# EAGLE schematic shield (EAGLE 7.3.0)
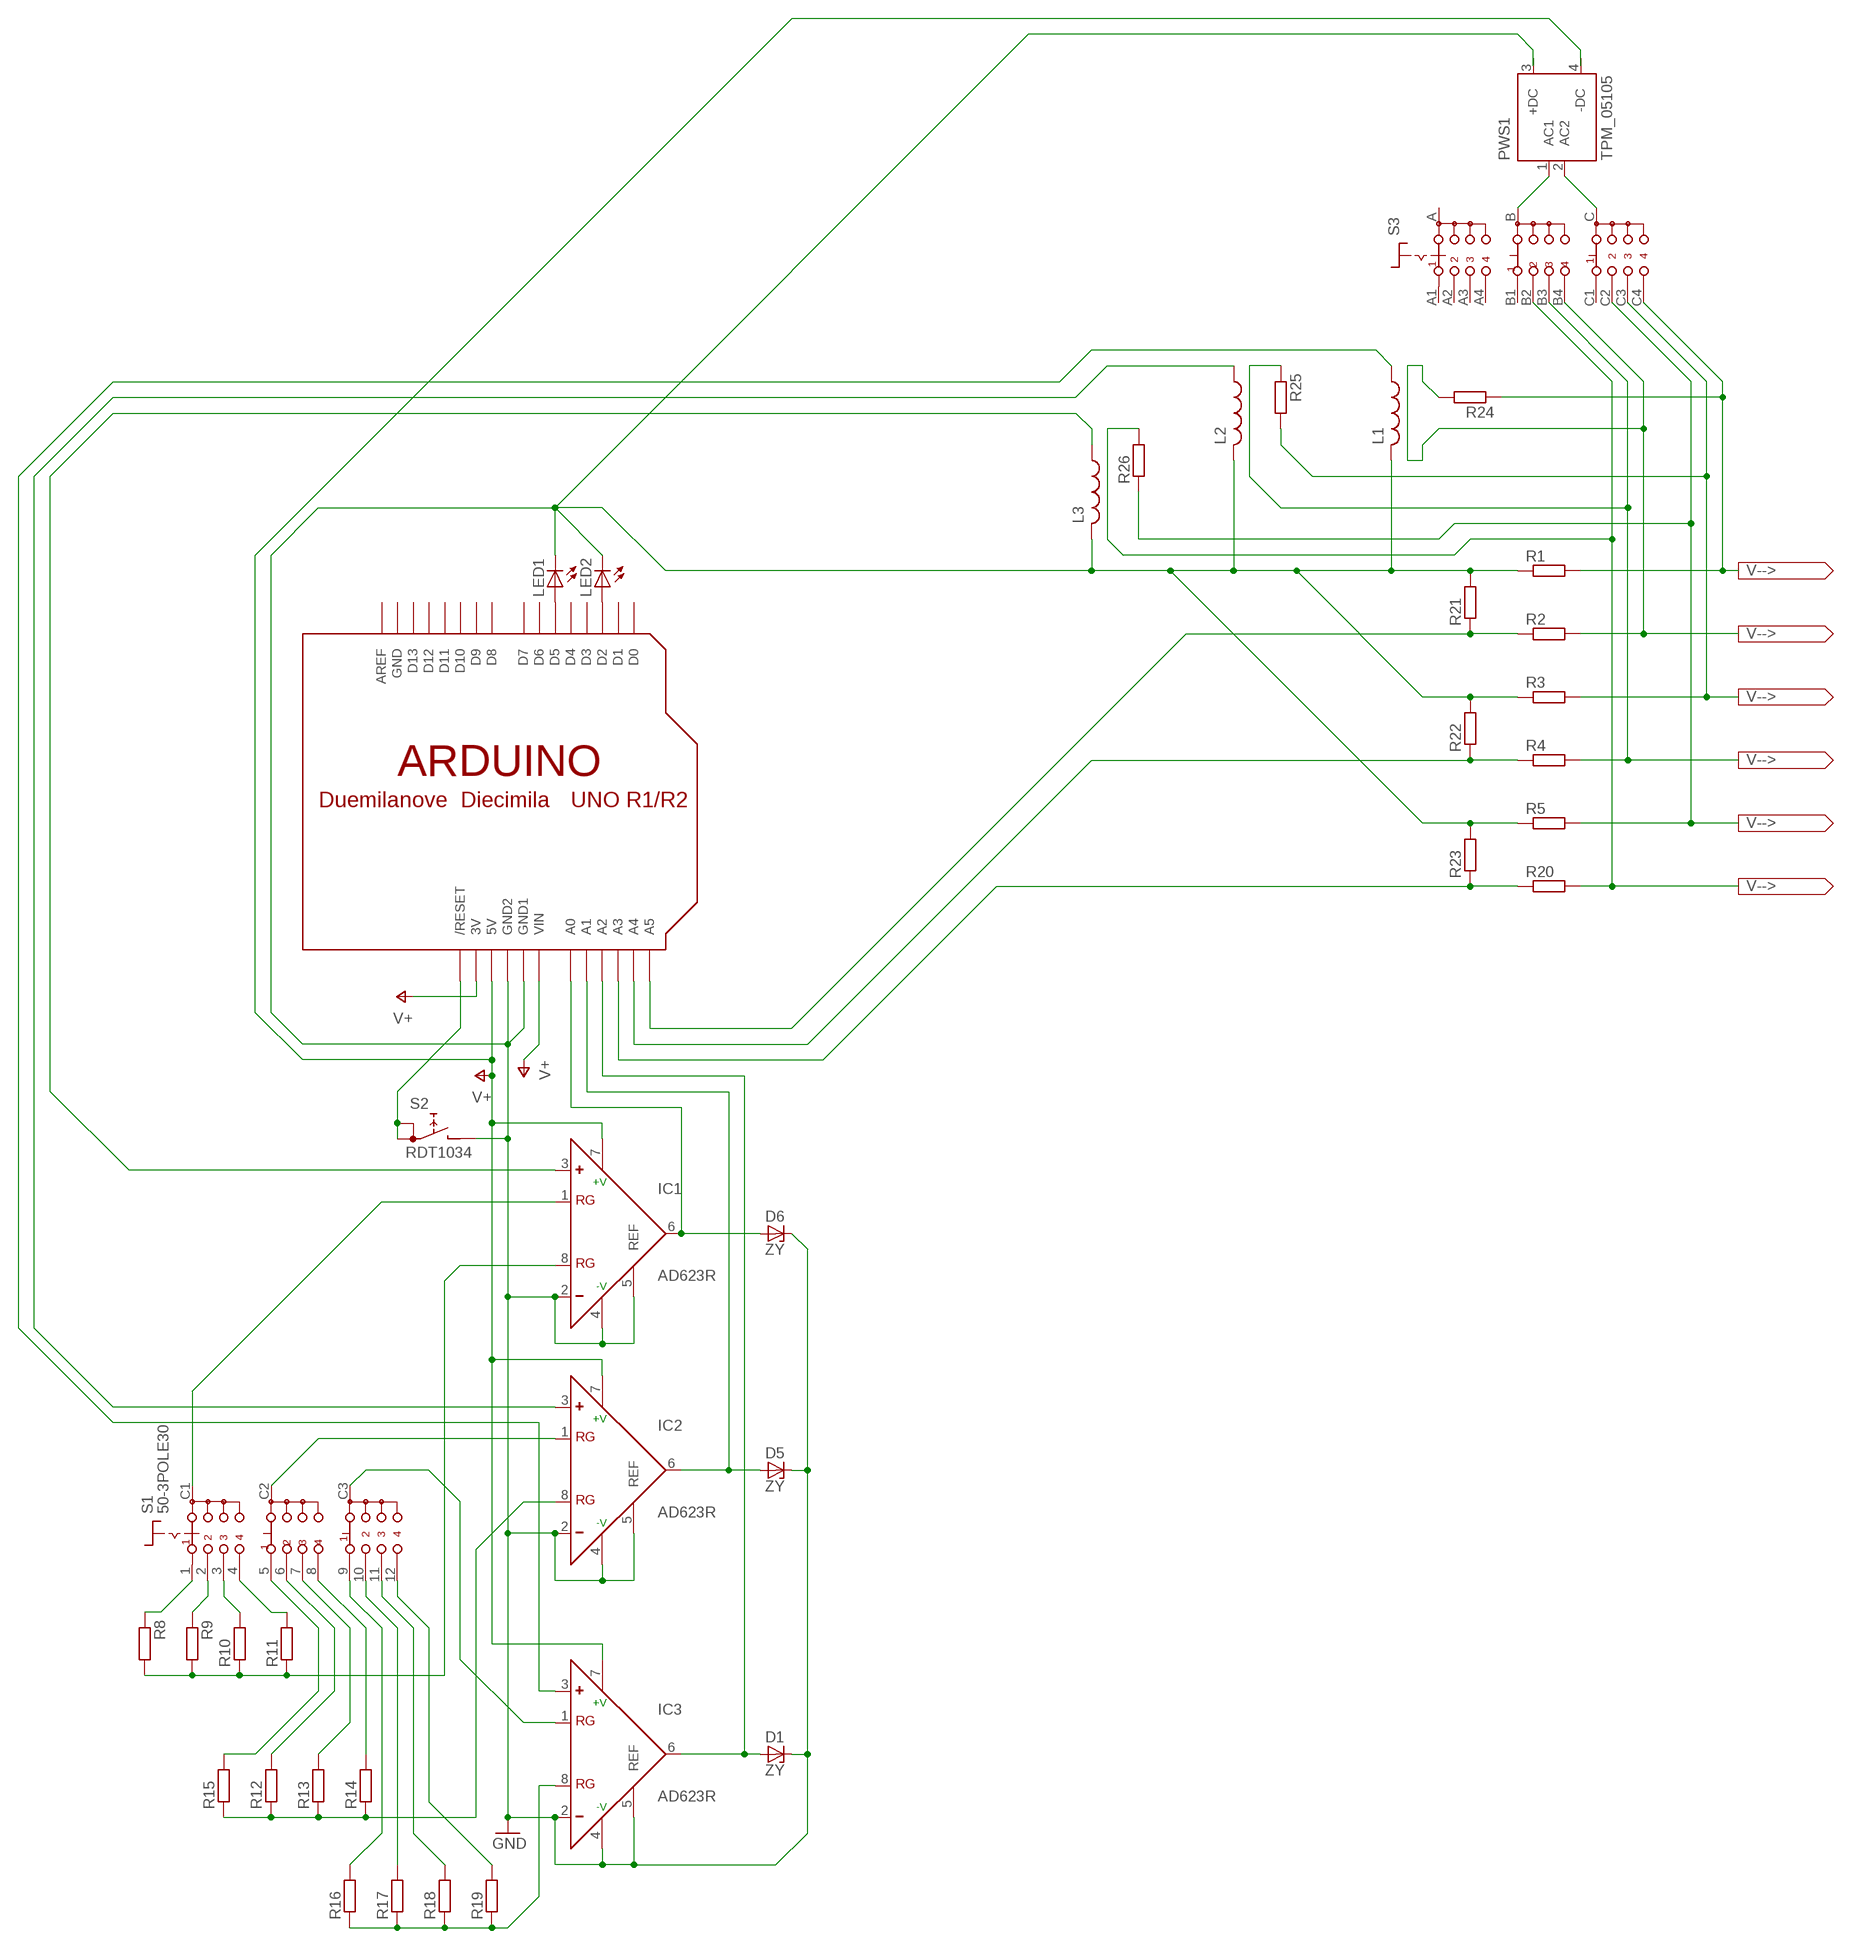
[diagram p0: schematic, sheet 1]

## Parts
D1  ZY  [P1Z12]
D5  ZY  [P1Z12]
D6  ZY  [P1Z12]
IC1  AD623R  [SO8]
IC2  AD623R  [SO8]
IC3  AD623R  [SO8]
L1  L-USL3216C  [L3216C]
L2  L-USL3216C  [L3216C]
L3  L-USL3216C  [L3216C]
LED1  LED5MM  [LED5MM]
LED2  LED5MM  [LED5MM]
PWS1  TPM_05105  [05105]
R1  R-EU_0617/22  [0617/22]
R2  R-EU_0617/22  [0617/22]
R3  R-EU_0617/22  [0617/22]
R4  R-EU_0617/22  [0617/22]
R5  R-EU_0617/22  [0617/22]
R8  R-EU_0207/10  [0207/10]
R9  R-EU_0207/10  [0207/10]
R10  R-EU_0207/10  [0207/10]
R11  R-EU_0207/10  [0207/10]
R12  R-EU_0207/10  [0207/10]
R13  R-EU_0207/10  [0207/10]
R14  R-EU_0207/10  [0207/10]
R15  R-EU_0207/10  [0207/10]
R16  R-EU_0207/10  [0207/10]
R17  R-EU_0207/10  [0207/10]
R18  R-EU_0207/10  [0207/10]
R19  R-EU_0207/10  [0207/10]
R20  R-EU_0617/22  [0617/22]
R21  R-EU_0207/10  [0207/10]
R22  R-EU_0207/10  [0207/10]
R23  R-EU_0207/10  [0207/10]
R24  R-EU_0207/10  [0207/10]
R25  R-EU_0207/10  [0207/10]
R26  R-EU_0207/10  [0207/10]
S1  50-3POLE30  [50-3POLE30]
S2  RDT1034  [RDT1034]
S3  CK103X04  [CK103X04]
U$1  ARDUINOUNO  [ARDUINO]

## Nets
GND: D1.C D5.C D6.C IC1.2(-) IC1.4(-V) IC1.5(REF) IC2.2(-) IC2.4(-V) IC2.5(REF) IC3.2(-) IC3.4(-V) IC3.5(REF) L1.2 L2.2 L3.2 LED1.K(C) LED2.K(C) R1.1 R3.1 R5.1 R21.2 R22.2 R23.2 S2.B U$1.GND1 U$1.GND2
N$1: R12.1
N$2: PWS1.1(AC1) S3.B
N$4: IC1.1(RG) S1.C1(A)
N$5: IC2.1(RG) S1.C2(B)
N$6: PWS1.2(AC2) S3.C
N$7: IC2.8(RG) R15.1
N$8: IC3.1(RG) S1.C3(C)
N$9: IC3.8(RG) R16.1
N$10: D6.A IC1.6(OUT) U$1.A0
N$11: D5.A IC2.6(OUT) U$1.A1
N$12: D1.A IC3.6(OUT) U$1.A2
N$13: R20.1 R23.1 U$1.A3
N$14: R4.1 R22.1 U$1.A4
N$15: R8.1 S1.1(A1)
N$16: R9.1 S1.2(A2)
N$17: R10.2 S1.3(A3)
N$18: R2.1 R21.1 U$1.A5
N$19: S2.A S2.A1 U$1.RESET(/RESET)
N$20: R11.2 S1.4(A4)
N$21: R15.2 S1.5(B1)
N$22: R12.2 S1.6(B2)
N$23: R13.2 S1.7(B3)
N$24: R14.2 S1.8(B4)
N$25: R16.2 S1.9(C1)
N$26: R17.2 S1.10(C2)
N$27: R18.2 S1.11(C3)
N$28: R19.2 S1.12(C4)
N$29: IC1.8(RG) R8.2 R9.2 R10.1 R11.1
N$30: R13.1
N$31: R14.1
N$32: R17.1
N$33: R18.1
N$34: R19.1
N$35: LED2.A U$1.D2
N$36: LED1.A U$1.D5
N$38: IC1.3(+) L3.1
N$40: IC3.3(+) L1.1
N$41: R1.2 R24.1 S3.C4
N$42: IC2.3(+) L2.1
N$43: R3.2 R25.2 S3.C3
N$45: R5.2 R26.1 S3.C2
N$46: R20.2 R26.2 S3.B2
N$47: R2.2 R24.2 S3.B4
N$48: R4.2 R25.1 S3.B3
V+: IC1.7(+V) IC2.7(+V) IC3.7(+V) U$1.3V U$1.5V U$1.VIN
Unconnected: PWS1.3(+DC) PWS1.4(-DC) S3.A S3.A1 S3.A2 S3.A3 S3.A4 S3.B1 S3.C1 U$1.AREF U$1.D0 U$1.D1 U$1.D3 U$1.D4 U$1.D6 U$1.D7 U$1.D8 U$1.D9 U$1.D10 U$1.D11 U$1.D12 U$1.D13

## Power pins joined to a net without a drawn wire
GND: U$1.GND

## Library data of the parts
D1 D5 D6 = diode:ZY: Z DIODE
IC1-IC3 = analog-devices:AD623: Single-Supply, Rail-to-Rail, Low Cost Instrumentation Amplifier Source: http://www.analog.com/static/imported-files/data_sheets/AD623.pdf; MPN: AD623ARZ.; OC_FARNELL: 9426213; OC_NEWARK: 31M4186
L1-L3 = resistor:L-US: INDUCTOR, American symbol
LED1 LED2 = led:LED: LED OSRAM: - CHIPLED LG R971, LG N971, LY N971, LG Q971, LY Q971, LO R971, LY R971 LH N974, LH R974 LS Q976, LO Q976, LY Q976 LO Q996 - Hyper CHIPLED LW Q18S LB Q993, LB Q99A, LB R99A - SideLED LS A670, LO A670, LY A670, LG A670, LP A670 LB A673, LV A673, LT A673, LW A673 LH A674 LY A675 LS A676, LA A676, LO A676, LY A676, LW A676 LS A679, LY A679, LG A679 - Hyper Micro SIDELED® LS Y876, LA Y876, LO Y876, LY Y876 LT Y87S - SmartLED LW L88C, LW L88S LB L89C, LB L89S, LG L890 LS L89K, LO L89K, LY L89K LS L896, LA L896, LO L896, LY L896 - TOPLED LS T670, LO T670, LY T670, LG T670, LP T670 LSG T670, LSP T670, LSY T670, LOP T670, LYG T670 LG T671, LOG T671, LSG T671 LB T673, LV T673, LT T673, LW T673 LH T674 LS T676, LA T676, LO T676, LY T676, LB T676, LH T676, LSB T676, LW T676 LB T67C, LV T67C, LT T67C, LS T67K, LO T67K, LY T67K, LW E67C LS E67B, LA E67B, LO E67B, LY E67B, LB E67C, LV E67C, LT E67C LW T67C LS T679, LY T679, LG T679 LS T770, LO T770, LY T770, LG T770, LP T770 LB T773, LV T773, LT T773, LW T773 LH T774 LS E675, LA E675, LY E675, LS T675 LS T776, LA T776, LO T776, LY T776, LB T776 LHGB T686 LT T68C, LB T68C - Hyper Mini TOPLED® LB M676 - Mini TOPLED Santana® LG M470 LS M47K, LO M47K, LY M47K Source: http://www.osram.convergy.de LUXEON: - LUMILED® LXK2-PW12-R00, LXK2-PW12-S00, LXK2-PW14-U00, LXK2-PW14-V00 LXK2-PM12-R00, LXK2-PM12-S00, LXK2-PM14-U00 LXK2-PE12-Q00, LXK2-PE12-R00, LXK2-PE12-S00, LXK2-PE14-T00, LXK2-PE14-U00 LXK2-PB12-K00, LXK2-PB12-L00, LXK2-PB12-M00, LXK2-PB14-N00, LXK2-PB14-P00, LXK2-PB14-Q00 LXK2-PR12-L00, LXK2-PR12-M00, LXK2-PR14-Q00, LXK2-PR14-R00 LXK2-PD12-Q00, LXK2-PD12-R00, LXK2-PD12-S00 LXK2-PH12-R00, LXK2-PH12-S00 LXK2-PL12-P00, LXK2-PL12-Q00, LXK2-PL12-R00 Source: www.luxeon.com KINGBRIGHT: KA-3528ASYC Source: www.kingbright.com
PWS1 = traco-electronic:TPM_*: DC/DC Konverter 5 Watt, 1 x Input, 1 x Output Source: http://www.tracopower.com/datasheet_g/tpm-d.pdf; OC_FARNELL: unknown; OC_NEWARK: unknown
R1-R5 R8-R26 = resistor:R-EU_: RESISTOR, European symbol
S1 = switch:50-3POLE30: SERIES 50 Single-Deck Rotary Switches three pole 30° Source: www.grayhill.com .. J-15-21.pdf
S2 = switch:RDT1034: PUSH SWITCH www.radiohm.com
S3 = switch:CK103X04: ROTARY SWITCH C&K
U$1 = adafruit:ARDUINO: Arduino Diecimila/Duemilanove Make a shield with ease, this package has all the named pins as well as the two mounting drill holes and an outline of the USB and DC power connector. The outline is on the DIMENSION layer, so if your board house uses it they will cut the outline to match. http://www.ladyada.net/library/pcb/eaglelibrary.html